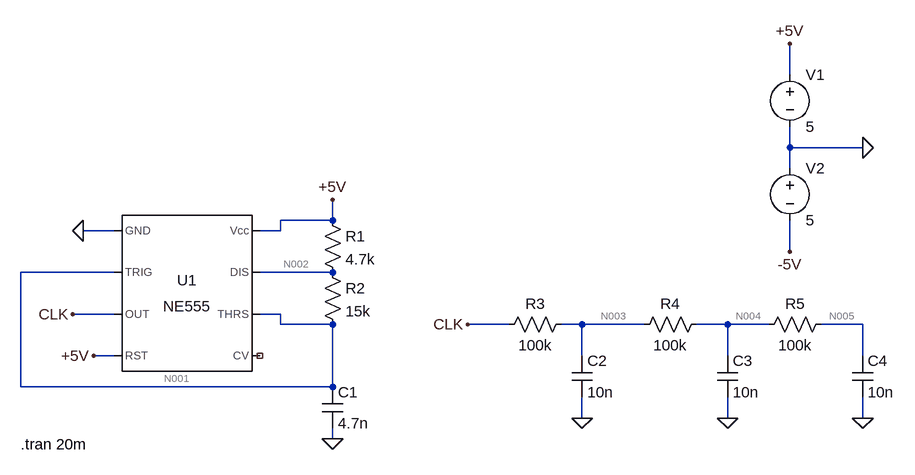
[diagram p0: schematic do#.asc]
do#.asc, the LTspice schematic file:
Version 4
SHEET 1 1176 680
WIRE 1008 -160 1008 -208
WIRE 1008 -48 1008 -80
WIRE 1120 -48 1008 -48
WIRE 1008 -16 1008 -48
WIRE 304 64 304 32
WIRE 304 64 224 64
WIRE -32 80 -80 80
WIRE 224 80 224 64
WIRE 224 80 192 80
WIRE 1008 112 1008 64
WIRE -32 144 -176 144
WIRE 304 144 192 144
WIRE -32 208 -96 208
WIRE 224 208 192 208
WIRE 224 224 224 208
WIRE 304 224 224 224
WIRE 576 224 512 224
WIRE 688 224 656 224
WIRE 784 224 688 224
WIRE 912 224 864 224
WIRE 976 224 912 224
WIRE 1120 224 1056 224
WIRE -32 272 -64 272
WIRE 688 272 688 224
WIRE 912 272 912 224
WIRE 1120 272 1120 224
WIRE -176 320 -176 144
WIRE 304 320 304 224
WIRE 304 320 -176 320
WIRE 688 368 688 336
WIRE 912 368 912 336
WIRE 1120 368 1120 336
WIRE 304 400 304 384
FLAG 1120 -48 0
FLAG 1008 -208 +5V
FLAG 1008 112 -5V
FLAG 304 32 +5V
FLAG -96 208 CLK
FLAG -64 272 +5V
FLAG -80 80 0
FLAG 304 400 0
FLAG 512 224 CLK
FLAG 688 368 0
FLAG 912 368 0
FLAG 1120 368 0
SYMBOL Misc\\NE555 80 176 R0
SYMATTR InstName U1
SYMBOL voltage 1008 -176 R0
WINDOW 123 0 0 Left 0
WINDOW 39 0 0 Left 0
SYMATTR InstName V1
SYMATTR Value 5
SYMBOL voltage 1008 -32 R0
WINDOW 123 0 0 Left 0
WINDOW 39 0 0 Left 0
SYMATTR InstName V2
SYMATTR Value 5
SYMBOL res 288 48 R0
SYMATTR InstName R1
SYMATTR Value 4.7k
SYMBOL res 288 128 R0
SYMATTR InstName R2
SYMATTR Value 15k
SYMBOL cap 288 320 R0
SYMATTR InstName C1
SYMATTR Value 4.7n
SYMBOL res 672 208 R90
WINDOW 0 0 56 VBottom 2
WINDOW 3 32 56 VTop 2
SYMATTR InstName R3
SYMATTR Value 100k
SYMBOL res 880 208 R90
WINDOW 0 0 56 VBottom 2
WINDOW 3 32 56 VTop 2
SYMATTR InstName R4
SYMATTR Value 100k
SYMBOL res 1072 208 R90
WINDOW 0 0 56 VBottom 2
WINDOW 3 32 56 VTop 2
SYMATTR InstName R5
SYMATTR Value 100k
SYMBOL cap 672 272 R0
SYMATTR InstName C2
SYMATTR Value 10n
SYMBOL cap 896 272 R0
SYMATTR InstName C3
SYMATTR Value 10n
SYMBOL cap 1104 272 R0
SYMATTR InstName C4
SYMATTR Value 10n
TEXT -176 408 Left 2 !.tran 20m

The netlist it stands for:
* do#.asc
XU1 0 N001 CLK +5V NC_01 N001 N002 +5V NE555  ; pins GND TRIG OUT RST CV THRS DIS Vcc
V1 +5V 0 5
V2 0 -5V 5
R1 +5V N002 4.7k
R2 N002 N001 15k
C1 N001 0 4.7n
R3 N003 CLK 100k
R4 N004 N003 100k
R5 N005 N004 100k
C2 N003 0 10n
C3 N004 0 10n
C4 N005 0 10n
.tran 20m
.lib NE555.sub
.backanno
.end

* Results of the author's LTspice run, read from the files saved beside the schematic
* Operating Point, zero values left out:
*   V(n001) = 5 V
*   V(+5v) = 5 V
*   V(n002) = 5 V
*   V(clk) = 5 V
*   V(-5v) = -5 V
*   V(n003) = 5 V
*   V(n004) = 5 V
*   V(n005) = 5 V
*   I(R2) = 10 nA
*   I(R1) = 16.67 nA
*   I(V1) = -1.611 mA
*   Ix(u1:1) = -1.611 mA
*   Ix(u1:2) = 5 nA
*   Ix(u1:4) = 22.67 µA
*   Ix(u1:6) = 5 nA
*   Ix(u1:7) = 6.672 nA
*   Ix(u1:8) = 1.588 mA
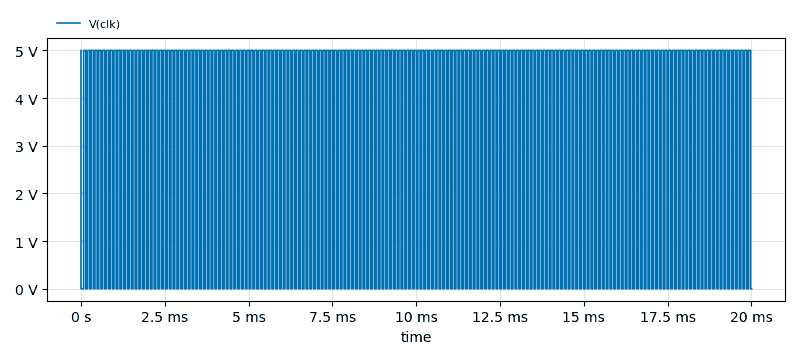
[diagram p1: Transient Analysis of do#.asc, plotted from the saved traces]
* Transient Analysis, 1 run:
*   V(clk): min 197.2 µV, max 5 V, average 2.826 V, rms 3.758 V, last 201 µV